# Altium schematic sheet TOP_CONTROLLER.SchDoc
size A3
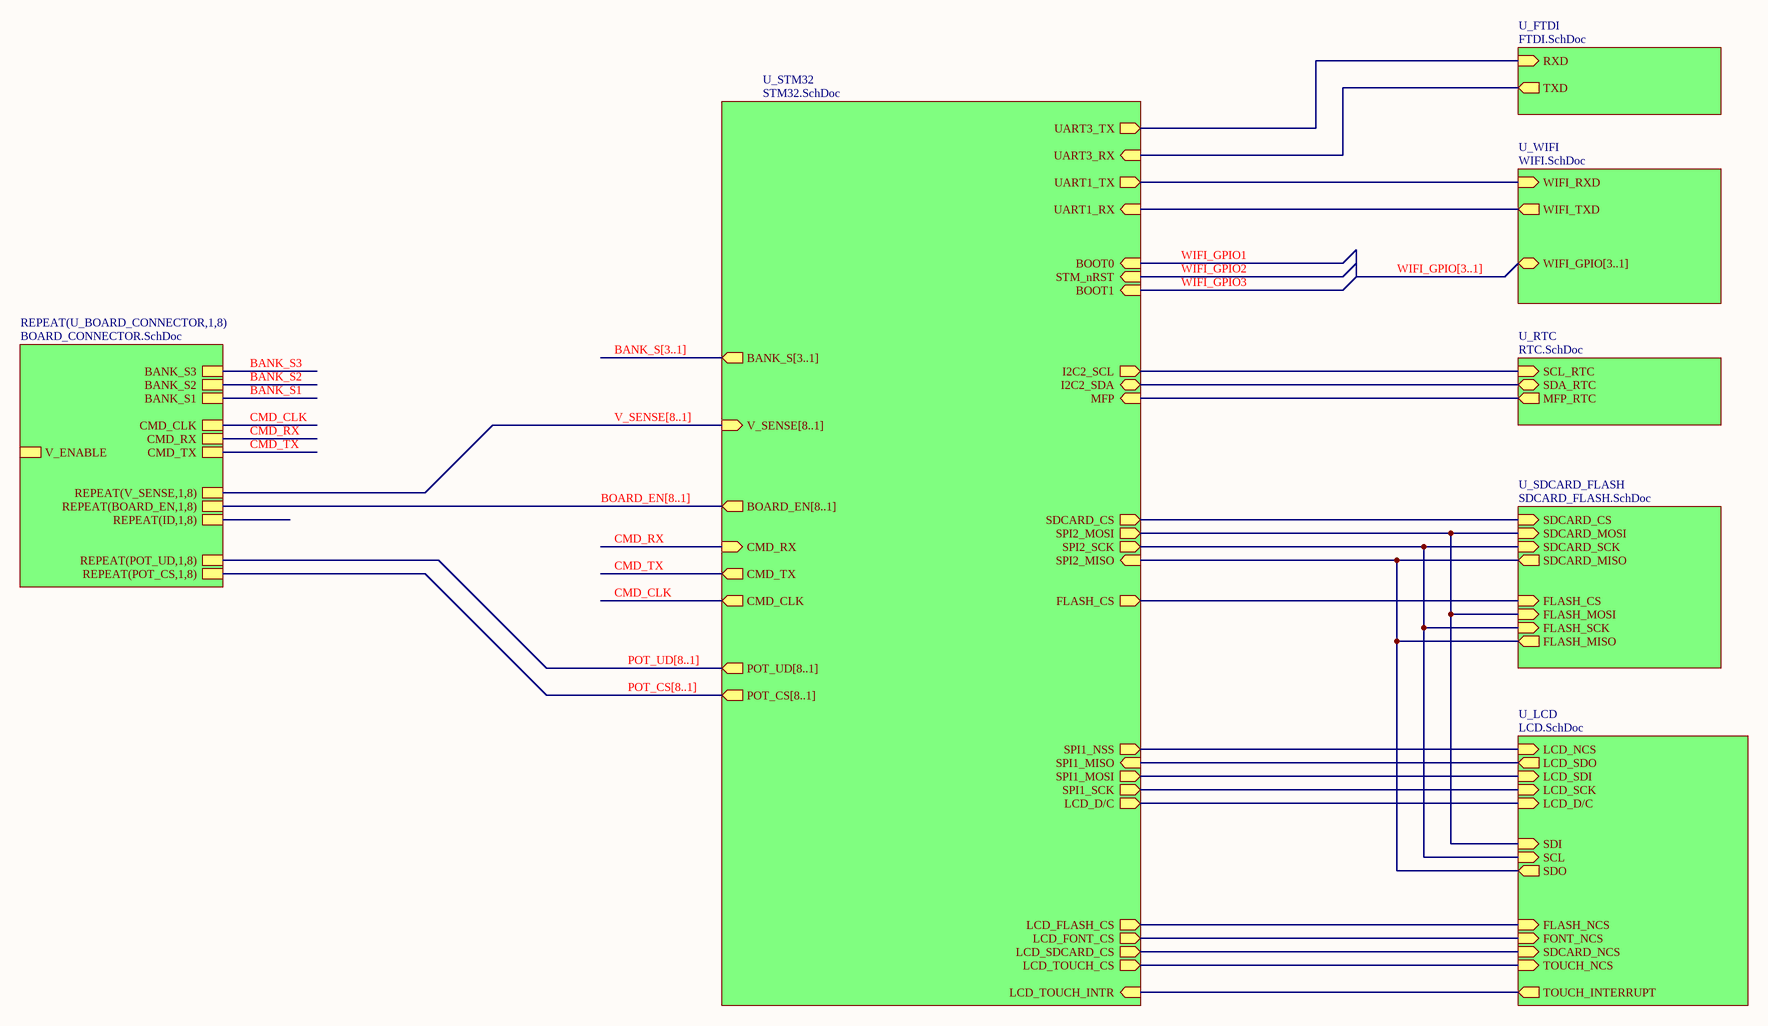
[diagram p0: TOP_CONTROLLER.SchDoc]

## Sub-sheets
REPEAT(U_BOARD_CONNECTOR,1,8) = BOARD_CONNECTOR.SchDoc: BANK_S3, BANK_S2, BANK_S1, CMD_CLK, REPEAT(POT_CS,1,8), CMD_TX, REPEAT(POT_UD,1,8), CMD_RX, V_ENABLE, REPEAT(BOARD_EN,1,8), REPEAT(V_SENSE,1,8), REPEAT(ID,1,8)
U_FTDI = FTDI.SchDoc: TXD (out), RXD (in)
U_LCD = LCD.SchDoc: TOUCH_INTERRUPT (out), SDO (out), SCL (in), SDI (in), FLASH_NCS (in), FONT_NCS (in), SDCARD_NCS (in), TOUCH_NCS (in), LCD_SCK (in), LCD_SDI (in), LCD_SDO (out), LCD_NCS (in), LCD_D/C (in)
U_RTC = RTC.SchDoc: SCL_RTC (in), SDA_RTC (bidir), MFP_RTC (out)
U_SDCARD_FLASH = SDCARD_FLASH.SchDoc: SDCARD_CS (in), SDCARD_MOSI (in), SDCARD_SCK (in), SDCARD_MISO (out), FLASH_CS (in), FLASH_MISO (out), FLASH_SCK (in), FLASH_MOSI (in)
U_STM32 = STM32.SchDoc: SPI1_NSS (out), SPI1_MOSI (out), SPI1_MISO (in), SPI1_SCK (out), SPI2_MOSI (out), SPI2_MISO (in), SPI2_SCK (out), I2C2_SCL (out), I2C2_SDA (bidir), UART1_TX (out), UART1_RX (in), UART3_RX (in), UART3_TX (out), CMD_CLK (out), CMD_TX (out), STM_nRST (in), V_SENSE[8..1] (in), BOOT0 (in), BOARD_EN[8..1] (out), BOOT1 (in), CMD_RX (in), MFP (in), FLASH_CS (out), SDCARD_CS (out), LCD_D/C (out), LCD_TOUCH_INTR (in), LCD_TOUCH_CS (out), LCD_FONT_CS (out), LCD_FLASH_CS (out), LCD_SDCARD_CS (out), BANK_S[3..1] (out), POT_UD[8..1] (out), POT_CS[8..1] (out)
U_WIFI = WIFI.SchDoc: WIFI_RXD (in), WIFI_TXD (out), WIFI_GPIO[3..1] (bidir)

## Nets
BANK_S1: sheet REPEAT(U_BOARD_CONNECTOR,1,8)/BANK_S1
BANK_S2: sheet REPEAT(U_BOARD_CONNECTOR,1,8)/BANK_S2
BANK_S3: sheet REPEAT(U_BOARD_CONNECTOR,1,8)/BANK_S3
CMD_CLK: sheet U_STM32/CMD_CLK, sheet REPEAT(U_BOARD_CONNECTOR,1,8)/CMD_CLK
CMD_RX: sheet U_STM32/CMD_RX, sheet REPEAT(U_BOARD_CONNECTOR,1,8)/CMD_RX
CMD_TX: sheet U_STM32/CMD_TX, sheet REPEAT(U_BOARD_CONNECTOR,1,8)/CMD_TX
WIFI_GPIO1: sheet U_STM32/BOOT0
WIFI_GPIO2: sheet U_STM32/STM_nRST
WIFI_GPIO3: sheet U_STM32/BOOT1
(unnamed): sheet U_RTC/SCL_RTC, sheet U_STM32/I2C2_SCL
(unnamed): sheet U_RTC/SDA_RTC, sheet U_STM32/I2C2_SDA
(unnamed): sheet U_RTC/MFP_RTC, sheet U_STM32/MFP
(unnamed): sheet U_FTDI/TXD, sheet U_STM32/UART3_RX
(unnamed): sheet U_FTDI/RXD, sheet U_STM32/UART3_TX
(unnamed): sheet U_WIFI/WIFI_RXD, sheet U_STM32/UART1_TX
(unnamed): sheet U_WIFI/WIFI_TXD, sheet U_STM32/UART1_RX
(unnamed): sheet U_STM32/SPI1_NSS, sheet U_LCD/LCD_NCS
(unnamed): sheet U_STM32/SPI1_MOSI, sheet U_LCD/LCD_SDI
(unnamed): sheet U_STM32/SPI1_MISO, sheet U_LCD/LCD_SDO
(unnamed): sheet U_STM32/SPI1_SCK, sheet U_LCD/LCD_SCK
(unnamed): sheet U_STM32/SPI2_MOSI, sheet U_SDCARD_FLASH/SDCARD_MOSI, sheet U_SDCARD_FLASH/FLASH_MOSI, sheet U_LCD/SDI
(unnamed): sheet U_STM32/SPI2_MISO, sheet U_SDCARD_FLASH/SDCARD_MISO, sheet U_SDCARD_FLASH/FLASH_MISO, sheet U_LCD/SDO
(unnamed): sheet U_STM32/SPI2_SCK, sheet U_SDCARD_FLASH/SDCARD_SCK, sheet U_SDCARD_FLASH/FLASH_SCK, sheet U_LCD/SCL
(unnamed): sheet U_STM32/FLASH_CS, sheet U_SDCARD_FLASH/FLASH_CS
(unnamed): sheet U_STM32/SDCARD_CS, sheet U_SDCARD_FLASH/SDCARD_CS
(unnamed): sheet U_STM32/LCD_D/C, sheet U_LCD/LCD_D/C
(unnamed): sheet U_STM32/LCD_TOUCH_INTR, sheet U_LCD/TOUCH_INTERRUPT
(unnamed): sheet U_STM32/LCD_TOUCH_CS, sheet U_LCD/TOUCH_NCS
(unnamed): sheet U_STM32/LCD_FONT_CS, sheet U_LCD/FONT_NCS
(unnamed): sheet U_STM32/LCD_FLASH_CS, sheet U_LCD/FLASH_NCS
(unnamed): sheet U_STM32/LCD_SDCARD_CS, sheet U_LCD/SDCARD_NCS

## Buses and harness runs
bus BANK_S[3..1] = sheet U_STM32/BANK_S[3..1]
bus BOARD_EN[8..1] = sheet U_STM32/BOARD_EN[8..1]
bus POT_CS[8..1] = sheet U_STM32/POT_CS[8..1]
bus POT_UD[8..1] = sheet U_STM32/POT_UD[8..1]
bus V_SENSE[8..1] = sheet U_STM32/V_SENSE[8..1]
bus WIFI_GPIO[3..1] = sheet U_WIFI/WIFI_GPIO[3..1]